# Altium schematic sheet SSOP-TSSOP14.SchDoc
size B
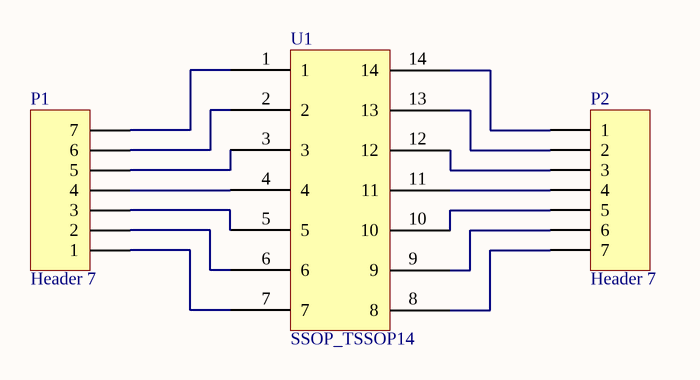
[diagram p0: SSOP-TSSOP14.SchDoc]

## Parts
P1  Header 7  [HDR1X7]
P2  Header 7  [HDR1X7]
U1  SSOP_TSSOP14  [SSOP-TSSOP14]

## Nets
NetP1_1: P1.1 U1.7
NetP1_2: P1.2 U1.6
NetP1_3: P1.3 U1.5
NetP1_4: P1.4 U1.4
NetP1_5: P1.5 U1.3
NetP1_6: P1.6 U1.2
NetP1_7: P1.7 U1.1
NetP2_1: P2.1 U1.14
NetP2_2: P2.2 U1.13
NetP2_3: P2.3 U1.12
NetP2_4: P2.4 U1.11
NetP2_5: P2.5 U1.10
NetP2_6: P2.6 U1.9
NetP2_7: P2.7 U1.8

## Library data of the parts
P1 P2 = Header 7: Header, 7-Pin; LatestRevisionDate: 17-Jul-2002; LatestRevisionNote: Re-released for DXP Platform.; Publisher: Altium Limited